# EAGLE design 619_romwriter (EAGLE 9.6.2)
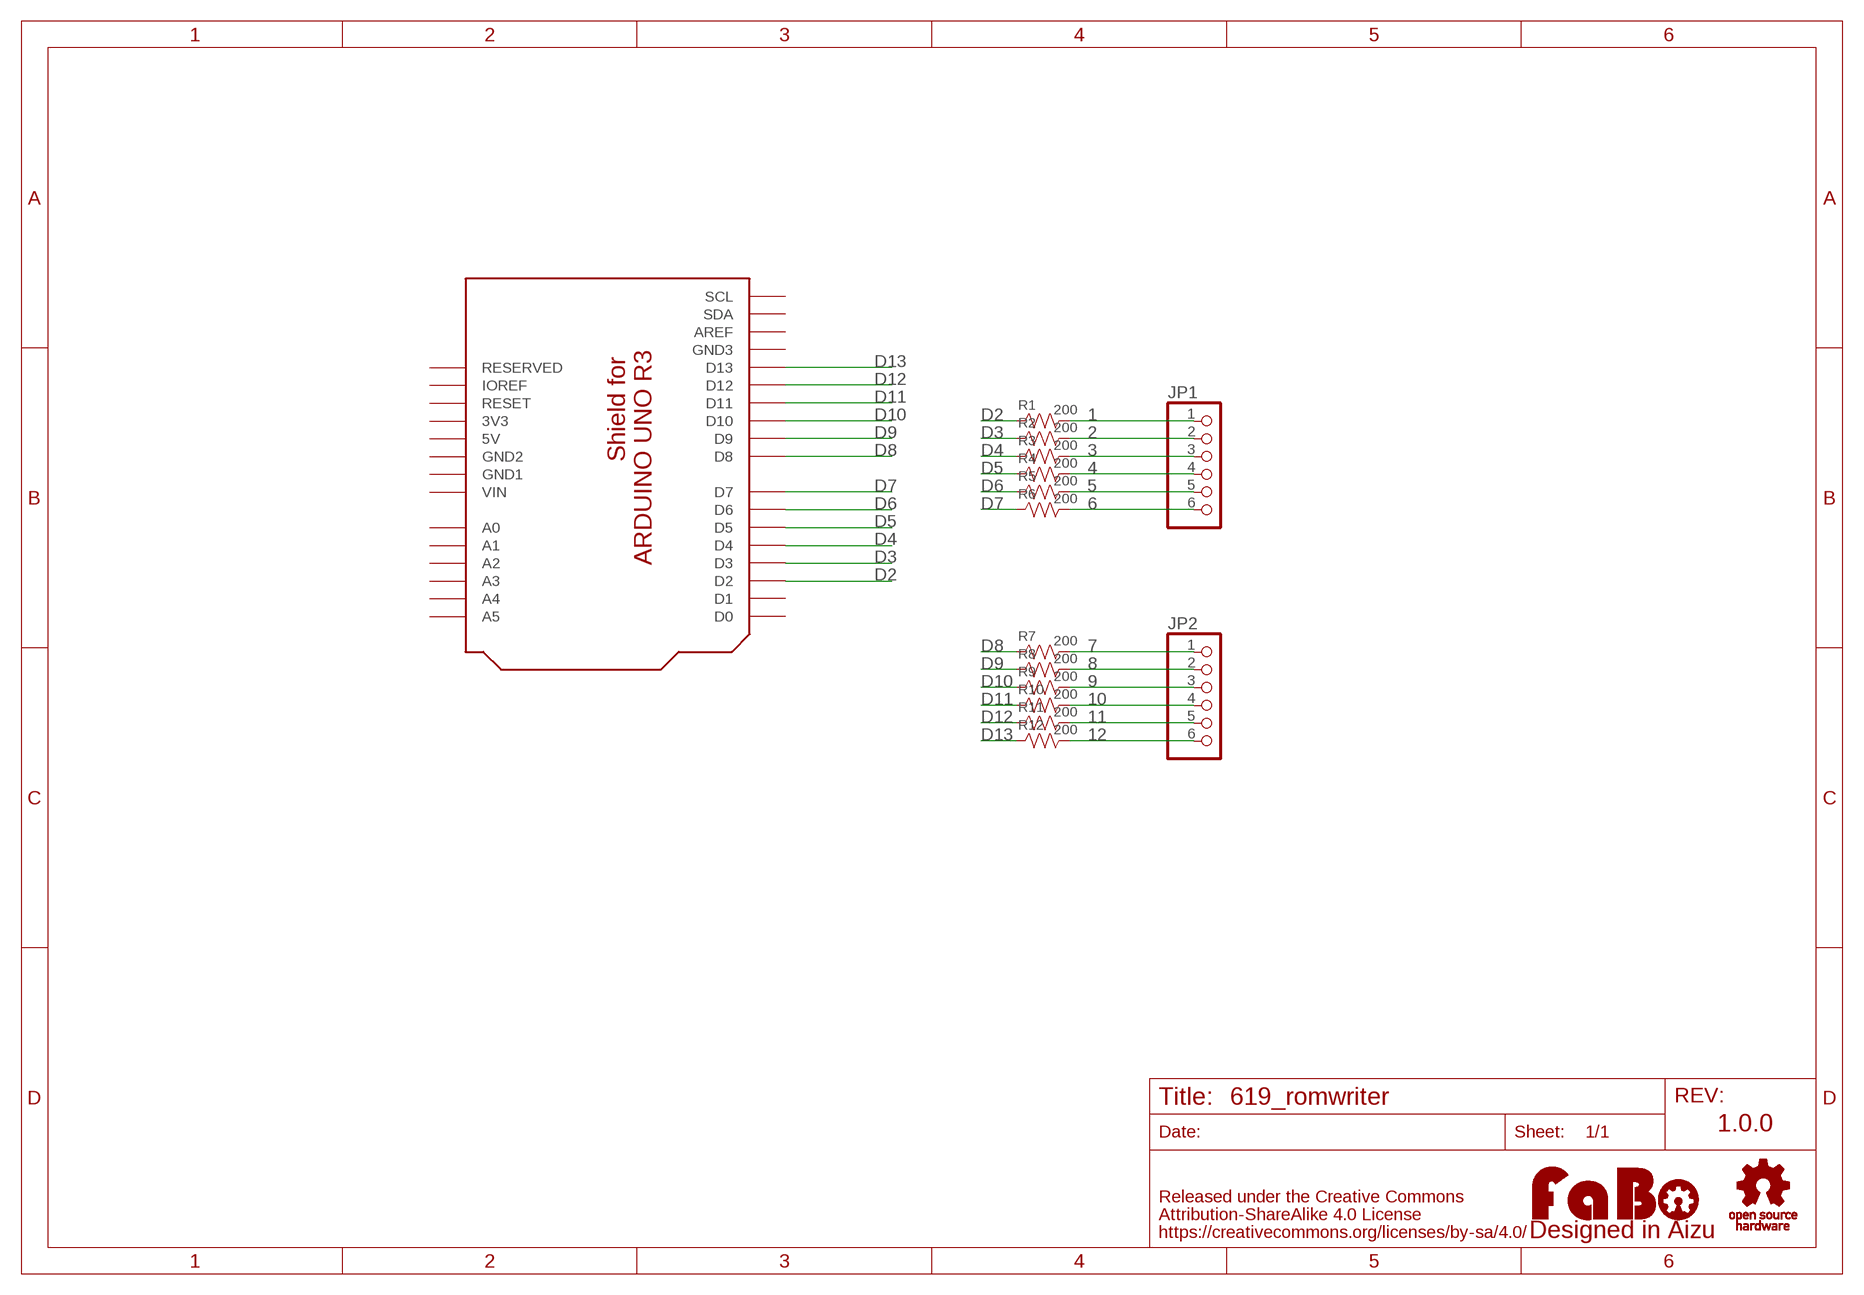
[diagram p0: schematic, sheet 1]

## Parts
JP1  PINHD-1X6  [1X06]
JP2  PINHD-1X6  [1X06]
LOGO1  LOGO_FABO-M  [LOGO_FABO_M]
R1  200  RESISTOR-0603  [0603]
R2  200  RESISTOR-0603  [0603]
R3  200  RESISTOR-0603  [0603]
R4  200  RESISTOR-0603  [0603]
R5  200  RESISTOR-0603  [0603]
R6  200  RESISTOR-0603  [0603]
R7  200  RESISTOR-0603  [0603]
R8  200  RESISTOR-0603  [0603]
R9  200  RESISTOR-0603  [0603]
R10  200  RESISTOR-0603  [0603]
R11  200  RESISTOR-0603  [0603]
R12  200  RESISTOR-0603  [0603]
U2  ARDUINO_UNO_R3_SHIELD-NOLABEL  [ARDUINO_UNO_R3_NOLABEL]
U$2  LOGO_OSHW-T_M  [LOGO_OSHW_T_MS]

## Nets
1: JP1.1 R1.2
2: JP1.2 R2.2
3: JP1.3 R3.2
4: JP1.4 R4.2
5: JP1.5 R5.2
6: JP1.6 R6.2
7: JP2.1 R7.2
8: JP2.2 R8.2
9: JP2.3 R9.2
10: JP2.4 R10.2
11: JP2.5 R11.2
12: JP2.6 R12.2
D2: R1.1 U2.D2
D3: R2.1 U2.D3
D4: R3.1 U2.D4
D5: R4.1 U2.D5
D6: R5.1 U2.D6
D7: R6.1 U2.D7
D8: R7.1 U2.D8
D9: R8.1 U2.D9
D10: R9.1 U2.D10
D11: R10.1 U2.D11
D12: R11.1 U2.D12
D13: R12.1 U2.D13
Unconnected: U2.A0 U2.A1 U2.A2 U2.A3 U2.A4 U2.A5 U2.AREF U2.D0 U2.D1 U2.IOREF U2.RESERVED U2.RESET U2.SCL U2.SDA

## Notes on the sheet
- 1.0.0

## Power pins joined to a net without a drawn wire
3V3: U2.3V3
5V: U2.5V
GND1: U2.GND1
GND2: U2.GND2
GND3: U2.GND3
VIN: U2.VIN

## Library data of the parts
JP1 JP2 = adafruit:PINHD-1X6: PIN HEADER
LOGO1 = component:LOGO_FABO
R1-R12 = FaBo-Resistors:RESISTOR: RESISTOR
U2 = FaBo-Boards:ARDUINO_UNO_R3_SHIELD
U$2 = FaBo-etc:LOGO_OSHW

## Net classes
0 default: width 0.305 mm

## Board
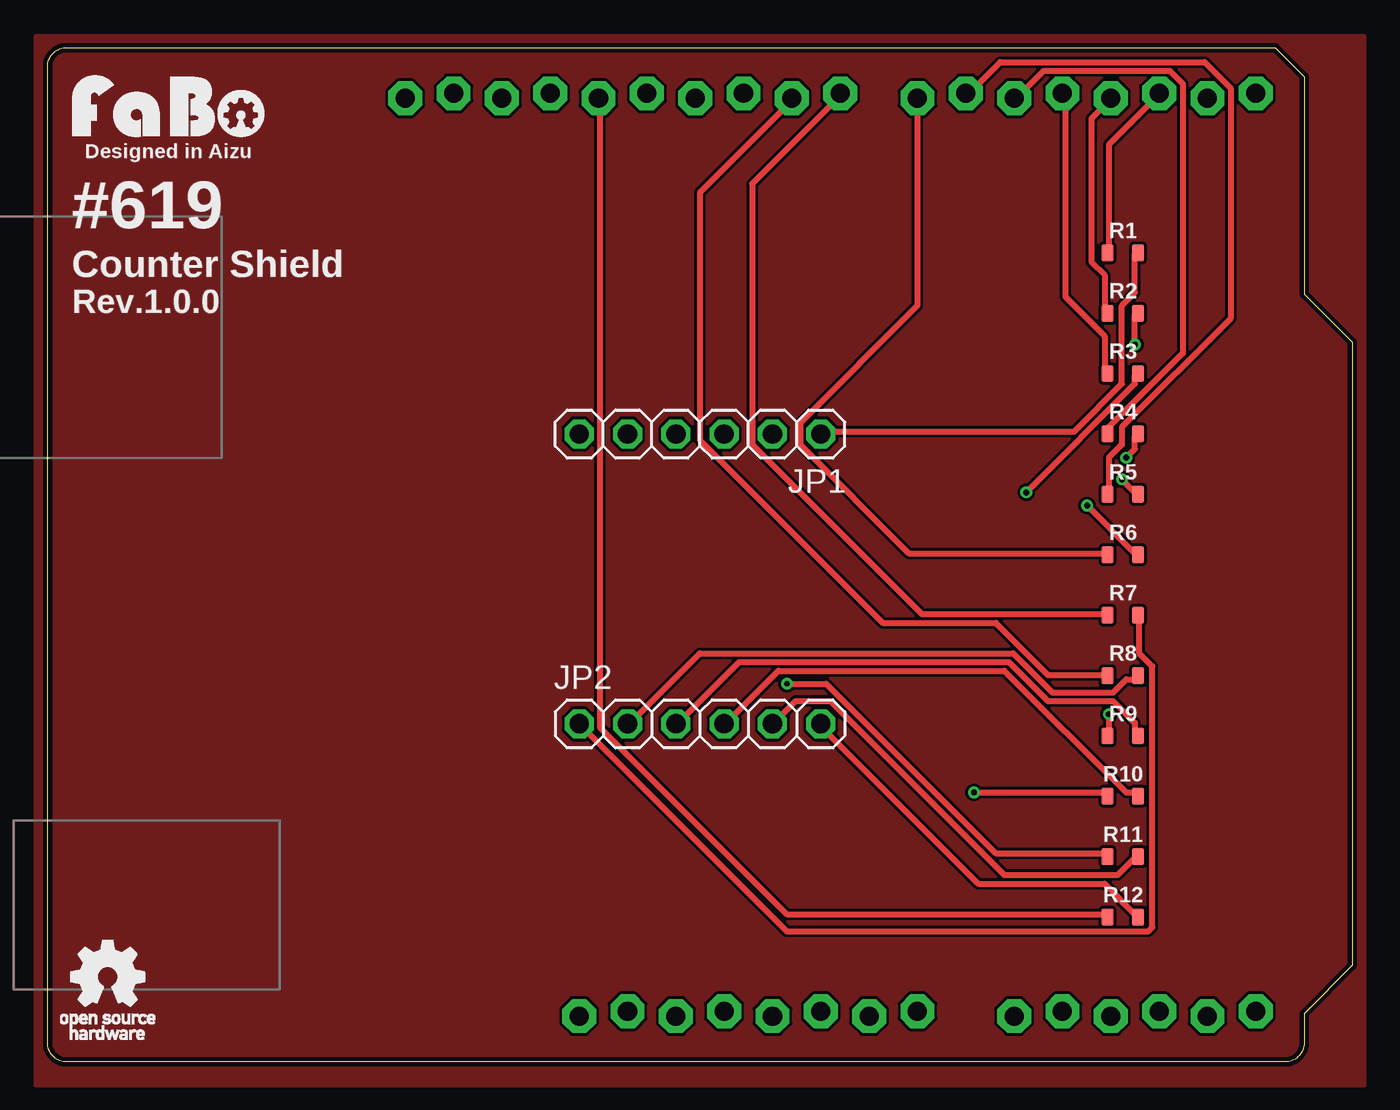
[diagram p1: board, top side]
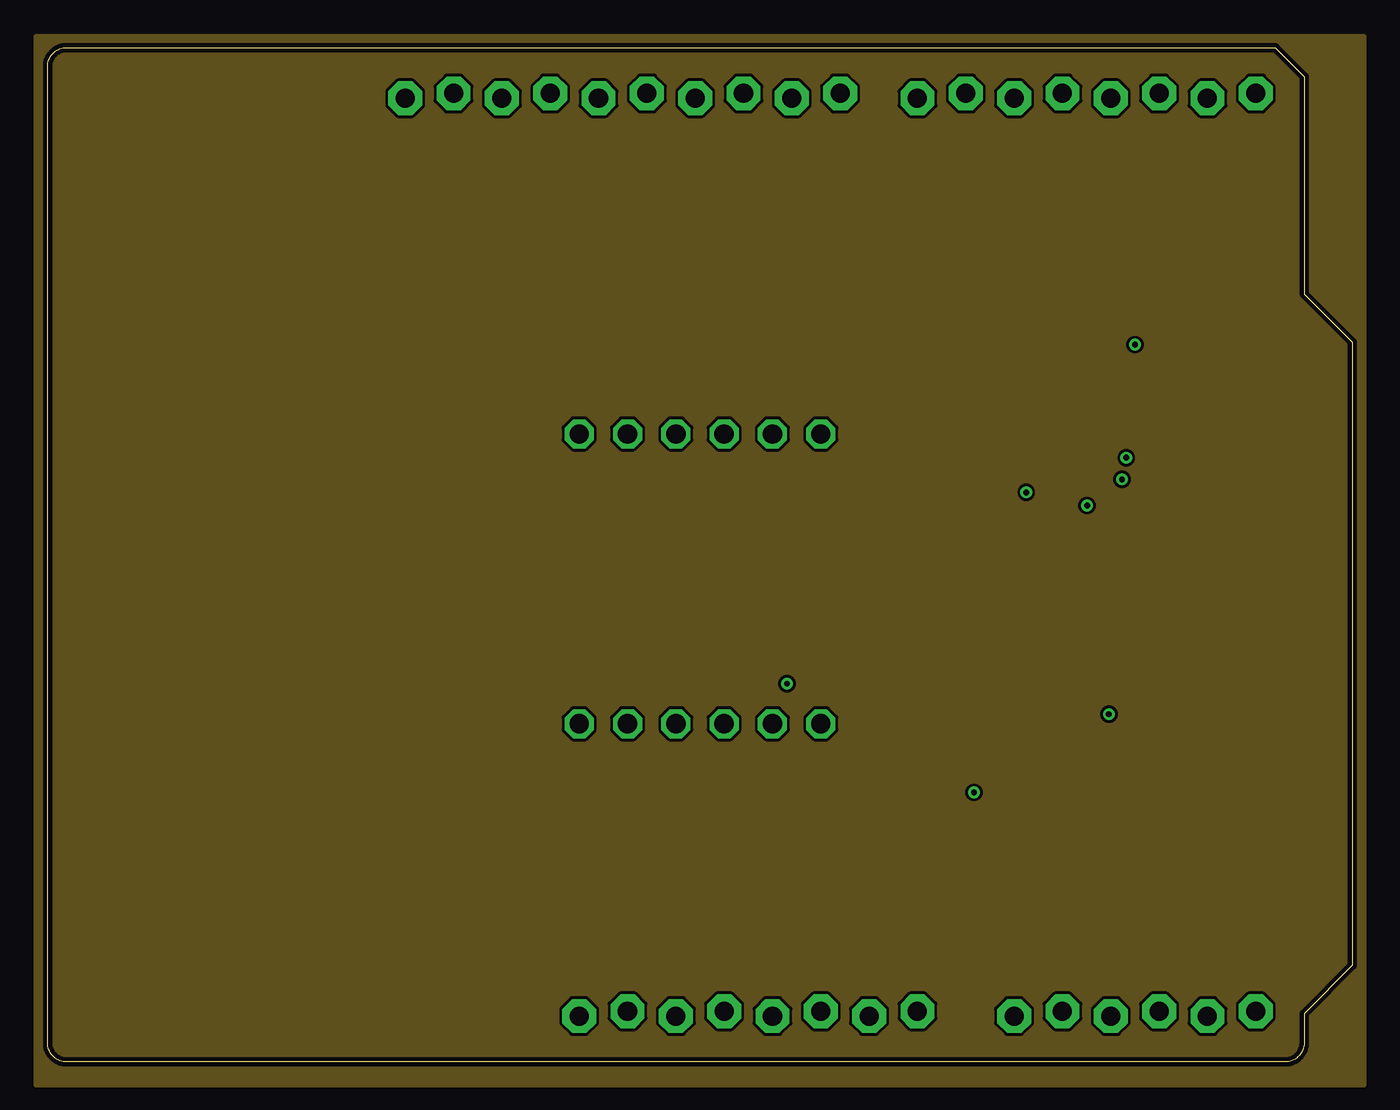
[diagram p2: board, inner layer Route2]
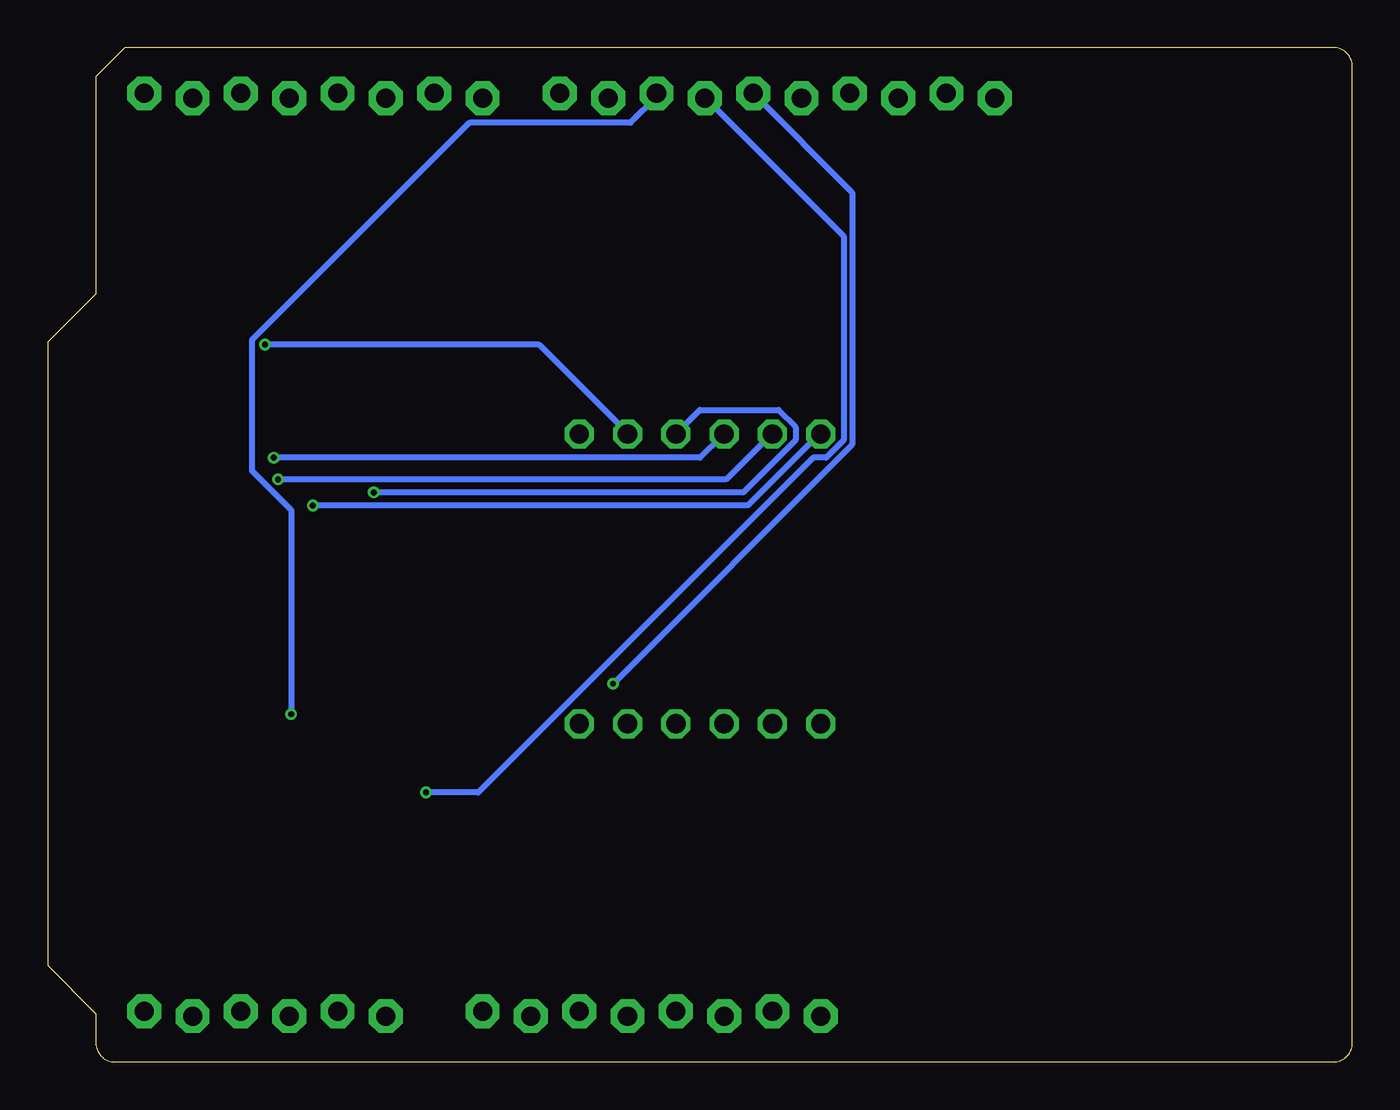
[diagram p3: board, bottom side, seen from below]

Size 68.58 x 53.34 mm. Coordinates in mm from the lower left corner, seen from the top.
Copper layers (1*16): Top 0.035mm / dielectric 1.6mm / Bottom 0.035mm
Design rules "PCBway": minimum track width 6mil, minimum drill 12mil, track to track 6mil, track to pad 6mil, pad to pad 6mil, via to via 6mil, smd to smd 6mil, copper to edge 10mil, drill to drill 10mil, minimum pad ring 10mil, minimum via ring 6mil, stop-mask expansion 2mil, vias tented up to drill 100mil, thermal gap 8mil

### Footprints (pad centres in the part's own frame; a part is rotated, then mirrored left to right if it is on the bottom)
1X06 = drill 1.016 octagon: 1 -6.35,0; 2 -3.81,0; 3 -1.27,0; 4 1.27,0; 5 3.81,0; 6 6.35,0
0603 = smd 0.65 x 0.9: 1 -0.8,0; 2 0.8,0
ARDUINO_UNO_R3_NOLABEL = drill 1 pad 1.778 octagon: 3V3 35.56,2.667; 5V 38.1,2.413; A0 50.8,2.413; A1 53.34,2.667; A2 55.88,2.413; A3 58.42,2.667; A4 60.96,2.413; A5 63.5,2.667; AREF 23.876,50.673; D0 63.5,50.927; D1 60.96,50.673; D2 58.42,50.927; D3 55.88,50.673; D4 53.34,50.927; D5 50.8,50.673; D6 48.26,50.927; D7 45.72,50.673; D8 41.656,50.927; D9 39.116,50.673; D10 36.576,50.927; D11 34.036,50.673; D12 31.496,50.927; D13 28.956,50.673; GND1 43.18,2.413; GND2 40.64,2.667; GND3 26.416,50.927; IOREF 30.48,2.667; RESERVED 27.94,2.413; RESET 33.02,2.413; SCL 18.796,50.673; SDA 21.336,50.927; VIN 45.72,2.667

### Placement (x,y rotation side)
JP1  34.29,33.02 180 top
JP2  34.29,17.78 0 top
LOGO1  6.35,48.26 0 top
R1  56.52,42.55 0 top
R2  56.52,39.37 0 top
R3  56.52,36.2 0 top
R4  56.52,33.02 0 top
R5  56.52,29.84 0 top
R6  56.52,26.67 0 top
R7  56.52,23.5 0 top
R8  56.52,20.32 0 top
R9  56.52,17.14 0 top
R10  56.52,13.97 0 top
R11  56.52,10.79 0 top
R12  56.52,7.62 0 top
U2  0,0 0 top
U$2  3.17,4.45 0 top

### Tracks (layer width: path | path; a pad name or v marks a point on that pad's centre or on a via)
1
  Top 0.305: R1.2 57.15,42.52 57.15,40.46 56.46,39.78 56.46,35.66 53.95,33.15 40.69,33.15 JP1.1
2  (via drill 0.3)
  Top 0.305: v57.15,37.72 57.15,39.32 R2.2
  Bottom 0.305: v57.15,37.72 42.75,37.72 38.18,33.15 JP1.2
3  (via drill 0.3)
  Top 0.305: v51.44,29.95 57.15,35.66 57.15,36.12 R3.2
  Bottom 0.305: v51.44,29.95 32,29.95 29.26,32.69 29.26,33.38 30.18,34.29 34.29,34.29 JP1.3
4  (via drill 0.3)
  Top 0.305: v56.69,31.77 57.15,32.23 57.15,32.92 R4.2
  Bottom 0.305: v56.69,31.77 34.29,31.77 33.15,32.92 JP1.4
5  (via drill 0.3)
  Top 0.305: v56.46,30.63 57.15,29.95 R5.2
  Bottom 0.305: v56.46,30.63 32.92,30.63 30.63,32.92 JP1.5
6  (via drill 0.3)
  Top 0.305: v54.63,29.26 57.15,26.75 R6.2
  Bottom 0.305: v54.63,29.26 31.77,29.26 28.12,32.92 JP1.6
7
  Top 0.305: JP2.1 38.86,6.86 57.84,6.86 58.06,7.09 58.06,20.8 57.38,21.49 57.38,23.32 R7.2
8
  Top 0.305: R8.2 57.15,20.12 56.69,20.12 56.01,19.43 52.81,19.43 50.75,21.49 34.29,21.49 30.63,17.83 JP2.2
9
  Top 0.305: R9.2 57.15,17.14 57.15,17.83 56.01,18.97 52.58,18.97 50.52,21.03 36.35,21.03 33.15,17.83 JP2.3
10
  Top 0.305: R10.2 57.15,14.17 56.69,14.17 50.29,20.57 38.41,20.57 35.66,17.83 JP2.4
11
  Top 0.305: R11.2 57.15,10.74 56.24,9.83 50.29,9.83 41.15,18.97 39.32,18.97 38.18,17.83 JP2.5
12
  Top 0.305: R12.2 57.15,7.77 55.55,9.37 48.92,9.37 40.69,17.6 JP2.6
D2
  Top 0.305: R1.1 55.78,42.75 55.78,48.23 58.29,50.75 U2.D2
D3
  Top 0.305: R2.1 55.55,39.55 55.55,41.38 54.86,42.06 54.86,49.61 55.78,50.52 U2.D3
D4
  Top 0.305: R3.1 55.55,36.35 55.55,38.18 53.49,40.23 53.49,50.75 U2.D4
D5
  Top 0.305: R4.1 55.78,33.15 55.78,33.38 59.66,37.26 59.66,51.44 58.98,52.12 52.35,52.12 50.98,50.75 U2.D5
D6
  Top 0.305: R5.1 55.78,29.95 55.78,31.77 56.46,32.46 56.46,33.38 62.18,39.09 62.18,51.21 60.81,52.58 50.06,52.58 48.46,50.98 U2.D6
D7
  Top 0.305: U2.D7 45.72,39.78 39.55,33.6 39.55,32.46 45.26,26.75 55.55,26.75 R6.1
D8
  Top 0.305: R7.1 55.55,23.55 45.95,23.55 37.03,32.46 37.03,46.18 41.6,50.75 U2.D8
D9
  Top 0.305: R8.1 55.55,20.34 52.58,20.34 49.84,23.09 43.89,23.09 34.29,32.69 34.29,45.72 39.09,50.52 U2.D9
D10  (via drill 0.3)
  Top 0.305: v55.78,18.29 55.78,17.14 R9.1
  Bottom 0.305: v55.78,18.29 55.78,29.03 57.84,31.09 57.84,37.95 46.41,49.38 37.95,49.38 36.58,50.75 U2.D10
D11  (via drill 0.3)
  Top 0.305: v48.69,14.17 55.55,14.17 R10.1
  Bottom 0.305: v48.69,14.17 45.95,14.17 28.35,31.77 27.66,31.77 26.75,32.69 26.75,43.43 33.83,50.52 U2.D11
D12  (via drill 0.3)
  Top 0.305: v38.86,19.89 40.92,19.89 49.84,10.97 55.55,10.97 R11.1
  Bottom 0.305: v38.86,19.89 26.29,32.46 26.29,45.72 U2.D12
D13
  Top 0.305: R12.1 55.55,7.77 38.86,7.77 29.03,17.6 29.03,50.52 U2.D13
GND
  pour Top: -0.64,-1.27 -0.64,53.98 69.22,53.98 69.22,-1.27
  pour Route2: -0.64,-1.27 -0.64,53.98 0,53.98 69.22,53.98 69.22,-1.27

### Text on the board
tPlace: Designed in Aizu | #619 | Counter Shield | Rev.1.0.0